# Altium schematic sheet 21D_SimpleLoRa_test.SchDoc
size A4
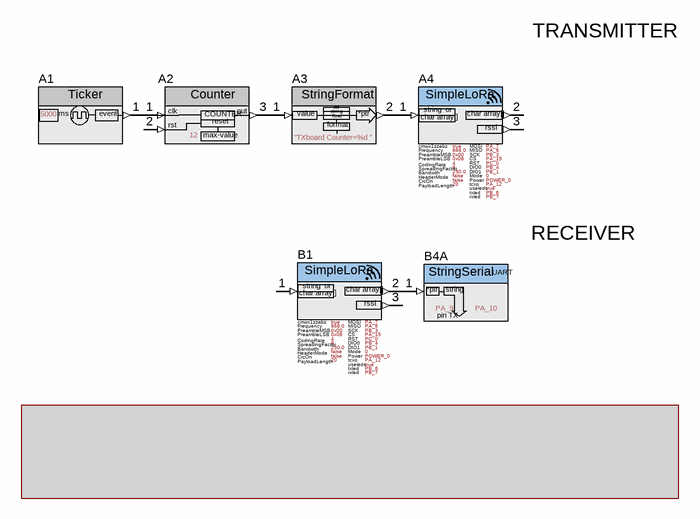
[diagram p0: 21D_SimpleLoRa_test.SchDoc]

## Parts
A1  Ticker  nBlocksParameter1: 5000
A2  Counter  nBlocksParameter1: 12
A3  StringFormat  nBlocksParameter1: "TXboard Counter=%d "
A4  SimpleLoRa  nBlocksParameter21: true  nBlocksParameter23: PB_7  nBlocksParameter22: PB_6  Parameter 23: rxled  Parameter 22: txled  Parameter 21: useleds  Parameter 20: tcxo  nBlocksParameter20: PA_12  nBlocksParameter19: POWER_0  Parameter 19: Power  Parameter 18: Mode  nBlocksParameter18: 0  nBlocksParameter17: PB_1  nBlocksParameter16: PB_4  nBlocksParameter15: PC_0  nBlocksParameter14: PA_15  nBlocksParameter13: PB_3  nBlocksParameter12: PA_6  nBlocksParameter11: PA_7  Parameter 17: DIO1  Parameter 16: DIO0  Parameter 15: RST  Parameter 14: CS  Parameter 13: SCK  Parameter 12: MISO  Parameter 11: MOSI  nBlocksParameter10: 20  nBlocksParameter9: false  nBlocksParameter7: 250.0  nBlocksParameter6: 9  nBlocksParameter5: 4  nBlocksParameter4: 0x08  nBlocksParameter3: 0x00  nBlocksParameter2: 868.0  Parameter 5: CodingRate  Parameter 6: SpreadingFactor  Parameter 7: Bandwith  Parameter 8: HeaderMode  Parameter 9: CrcOn  Parameter 10: PayloadLength  Parameter 2: Frequency  Parameter 4: PreambleLSB  Parameter 3: PreambleMSB  Parameter 1: cmwx1zzabz
B1  SimpleLoRa  nBlocksParameter21: true  nBlocksParameter23: PB_7  nBlocksParameter22: PB_6  Parameter 23: rxled  Parameter 22: txled  Parameter 21: useleds  Parameter 20: tcxo  nBlocksParameter20: PA_12  nBlocksParameter19: POWER_0  Parameter 19: Power  Parameter 18: Mode  nBlocksParameter18: 0  nBlocksParameter17: PB_1  nBlocksParameter16: PB_4  nBlocksParameter15: PC_0  nBlocksParameter14: PA_15  nBlocksParameter13: PB_3  nBlocksParameter12: PA_6  nBlocksParameter11: PA_7  Parameter 17: DIO1  Parameter 16: DIO0  Parameter 15: RST  Parameter 14: CS  Parameter 13: SCK  Parameter 12: MISO  Parameter 11: MOSI  nBlocksParameter10: 20  nBlocksParameter9: false  nBlocksParameter7: 250.0  nBlocksParameter6: 9  nBlocksParameter5: 4  nBlocksParameter4: 0x08  nBlocksParameter3: 0x00  nBlocksParameter2: 868.0  Parameter 5: CodingRate  Parameter 6: SpreadingFactor  Parameter 7: Bandwith  Parameter 8: HeaderMode  Parameter 9: CrcOn  Parameter 10: PayloadLength  Parameter 2: Frequency  Parameter 4: PreambleLSB  Parameter 3: PreambleMSB  Parameter 1: cmwx1zzabz
B4  StringSerial  nBlocksParameter2: PA_10  nBlocksParameter1: PA_9  (part A of 2)

## Nets
NetA1_1: A1.1(OUT) A2.1(COUNT-IN)
NetA2_3: A2.3(OUT) A3.1(IN)
NetA3_2: A3.2(OUT) A4.1(ValueIn)
NetB1_2: B1.2(payload) B4.1(TX)

Not connected (* = marked no-connect by the designer): A2 2(RESET); A4 2(payload) 3(rssi); B1 1(ValueIn) 3(rssi)

## Notes on the sheet
- TRANSMITTER
- RECEIVER
- (in symbol NODE-COUNTER) clk; out; COUNTER; rst; reset; max-value
- (in symbol NODE-SimpleLoRa) string  or; char array[]
- (in symbol NODE-STRINGFORMAT) int; string; value; float; *ptr; format
- (in symbol NODE-STRINGSERIAL-split, part A) UART; *ptr; string; pin TX
- (in symbol NODE-TICKER) ms; event

## Library data of the parts
A1 = NODE-TICKER: Creates a Periodical Event; ComponentLink1Description: link; ComponentLink1URL: https://github.com/nBlocksStudioNodes/nblocks_ticker
A2 = NODE-COUNTER: Ressetable Counter. Returns to zero, when max-value is reached; Parameter 1: AutoResetValue; ComponentLink1Description: link; ComponentLink1URL: https://github.com/nBlocksStudioNodes/nblocks_counter
A3 = NODE-STRINGFORMAT: # StringFormat / Adds Formatting to a number in printf style / *  Category: String / *  HAL: mbed / *  Tested: LPC1768, STM32F103, STM32F401, nRF52832 / *  Author: Fernando Cosentino / ## Inputs/Outputs / *  (1) Input int: Value in form of string, or int or float / *  (2) Output uint32_t: Pointer to array of string, or int, or float / ## Parameters / *  formatString: example "Value: %d\n" / ## Example: / [Ticker][Counter][StringFormat][StringSerial] / Prints / “Value: 0” / “Value: 1” / “Value: 3” / …; ComponentLink1Description: link; ComponentLink1URL: https://github.com/nBlocksStudioNodes/nblocks_stringformat; Parameter 1: formatString
A4 B1 = NODE-SimpleLoRa: # SimpleLoRa / SubGHz Radio with LoRa modulation. / SubGHz Radio with LoRa modulation. Will work on boards based on Murata CMWX1ZZABZ and potentially, on boards with mbed supported Microprocessor and SX1276 radio. / This Node Supports the long range LoRa modulation, not a Wide Area Network protocol. / *  Category: Radio / *  HAL: mbed / *  Tested: CMWX1ZZABZ (Murata Module SX1276, STM32L072, TCXO), n-PRO-40, n-DAP / *  Author: N. Chalikias / ## Input /Output data types / If the node is used as TX and the input is array of char, it will have the same format as the output of the RX node, so the two radio nodes become transparent. / If the input in TX node is string, the RX node will convert it to array of char, so the output of RX will not be the of the same type. / ## Input / *  (Schematic pin 1) two options, Pointer to: / *  *string / *  *array / ## Outputs / *  (Schematic pin 2) *array of char: Payload / *  (Schematic pin 3)  int: RSSI of the received Payload / ## Parameters: / *  cmwx1zzabz: bool: true for CMWX1ZZABZ, false for SX1276 without TCXO module / *  Frequency: float: 137.0 to 1020.0 MHz for SX1276, 860-930MHz for CMWX1ZZABZ (due to antenna matching) / *  PreambleMSB: uint8_t: 0 to 0xFF, number of preamble transmission symbols / *  PreambleLSB: uint8_t: 6 to 0xFF,  number of preamble transmission symbols / *  CodingRate: uint8_t: 1, 2, 3, 4 / *  SpreadingFactor: uint8_t: 6, 7, 8, 9, 10, 11, 12 / *  Bandwidth: int: use 8 for 7.8, 11 for 10.4, 16 for 15.6, 21 for 20.8, 32 for 31.25, 42 for 41.7, 63 for 62.5, 125, 250, 500 kHz (result at Register level: 0=7.8KHz,1,2,3,4,5,6,7,8,9=500KHz) / *  HeaderMode: bool: true for Implicit Header, false for Explicit Header / *  CrcOn: bool: / *  PayloadLength: uint8_t: 1 to 255 bytes for SX1276, 32 Bytes limit for the Node to save RAM / *  MOSI: PinName: Microcontroller pin to SX1276 / *  MISO : PinName: Microcontroller pin to SX1276 / *  SCK : PinName: Microcontroller pin to SX1276 / *  CS : PinName: Microcontroller pin to SX1276 / *  RST : PinName: Microcontroller pin to SX1276 / *  DIO0 : PinName: Microcontroller pin from SX1276 / *  DIO1 : PinName: Microcontroller pin from SX1276 / *  Mode: uint8_t: 0 RX and when Input is triggered TX the packet, 1 TX only, 2 RX only / *  Power: PowerTx: POWER_MIN1, POWER_0, POWER_2, POWER_5, POWER_8, POWER_10, POWER_15, POWER_17, POWER_20  in dBm / *  tcxo: PinName: Microcontroller pin to CMWX1ZZABZ TCXO / *  useleds: bool: true for using leds / *  ledtx: PinName: ledtx / *  ledtx: PinName: ledrx / ## Example: / Transmitter:  [Ticker]-->[Counter]-->[StringFormat]-->[SimpleLoRa]-->RF ))) / Receiver:  ((( RF--> [SimpleLoRa]-->[StringSerial]; ComponentLink1Description: link; ComponentLink1URL: https://github.com/nBlocksStudioNodes/nblocks_simplelora; nBlocksParameter8: false; nBlocksParameter1: true
B4 = NODE-STRINGSERIAL-split: StringSerial / This node implements a serial port, where characters received from the external world (RX pin) are sent one by one to the node's output, but the node's input expects a full string object as input (sent entirely within one frame to the TX pin). / DO NOT CONNECT integer data into this node, as it will definitely lead to incorrect behaviour, sending random bytes in unpredicted amount to the serial port. This can be harmful depending on your design.; Parameter 2: pinRX; Parameter 1: pinTX; ComponentLink1Description: link; ComponentLink1URL: https://github.com/nBlocksStudioNodes/nblocks_stringserial